# EAGLE design UCirKitUserStudy4 (EAGLE 7.3.0)
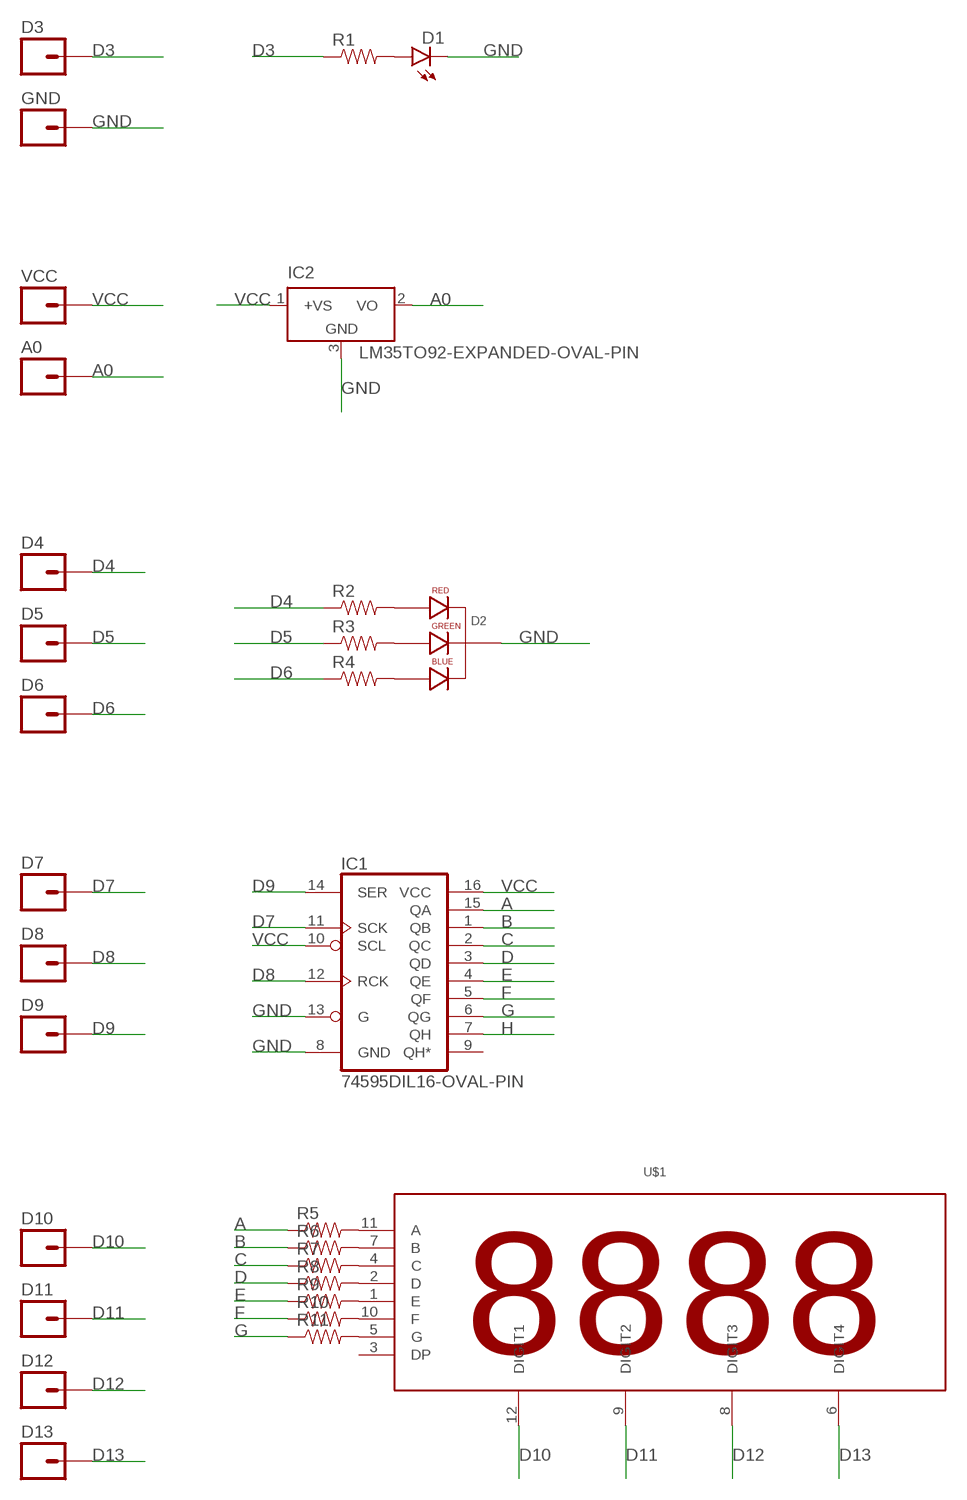
[diagram p0: schematic, sheet 1]

## Parts
A0  M01OVAL_PIN  [1X01_OVAL_PIN]
D1  LEDLED3MM-EXPANDED-OVAL-PIN  [LED3MM-EXPANDED-OVAL-PIN]
D2  LED-RGB-CC-THRULED-RGB-THRU-EXPANDED-OVAL-PIN  [LED-RGB-THRU-EXPANDED-OVAL-PIN]
D3  M01OVAL_PIN  [1X01_OVAL_PIN]
D4  M01OVAL_PIN  [1X01_OVAL_PIN]
D5  M01OVAL_PIN  [1X01_OVAL_PIN]
D6  M01OVAL_PIN  [1X01_OVAL_PIN]
D7  M01OVAL_PIN  [1X01_OVAL_PIN]
D8  M01OVAL_PIN  [1X01_OVAL_PIN]
D9  M01OVAL_PIN  [1X01_OVAL_PIN]
D10  M01OVAL_PIN  [1X01_OVAL_PIN]
D11  M01OVAL_PIN  [1X01_OVAL_PIN]
D12  M01OVAL_PIN  [1X01_OVAL_PIN]
D13  M01OVAL_PIN  [1X01_OVAL_PIN]
GND  M01OVAL_PIN  [1X01_OVAL_PIN]
IC1  74595DIL16-OVAL-PIN  [DIL16-OVAL-PIN]
IC2  LM35TO92-EXPANDED-OVAL-PIN  [TO92-EXPANDED-OVAL-PIN]
R1  1KOHM-1/4W-1%(PTH)PTH-EXPANDED-OVAL-PIN  [PTH-EXPANDED-OVAL-PIN]
R2  1KOHM-1/4W-1%(PTH)PTH-EXPANDED-OVAL-PIN  [PTH-EXPANDED-OVAL-PIN]
R3  1KOHM-1/4W-1%(PTH)PTH-EXPANDED-OVAL-PIN  [PTH-EXPANDED-OVAL-PIN]
R4  1KOHM-1/4W-1%(PTH)PTH-EXPANDED-OVAL-PIN  [PTH-EXPANDED-OVAL-PIN]
R5  1KOHM-1/4W-1%(PTH)PTH-EXPANDED-OVAL-PIN  [PTH-EXPANDED-OVAL-PIN]
R6  1KOHM-1/4W-1%(PTH)PTH-EXPANDED-OVAL-PIN  [PTH-EXPANDED-OVAL-PIN]
R7  1KOHM-1/4W-1%(PTH)PTH-EXPANDED-OVAL-PIN  [PTH-EXPANDED-OVAL-PIN]
R8  1KOHM-1/4W-1%(PTH)PTH-EXPANDED-OVAL-PIN  [PTH-EXPANDED-OVAL-PIN]
R9  1KOHM-1/4W-1%(PTH)PTH-EXPANDED-OVAL-PIN  [PTH-EXPANDED-OVAL-PIN]
R10  1KOHM-1/4W-1%(PTH)PTH-EXPANDED-OVAL-PIN  [PTH-EXPANDED-OVAL-PIN]
R11  1KOHM-1/4W-1%(PTH)PTH-EXPANDED-OVAL-PIN  [PTH-EXPANDED-OVAL-PIN]
U$1  4DIGIT_SEVEN_SEGMENT4DIGIT_SEVEN_SEGMENT_OVAL_PIN  [4DIGIT_SEVEN_SEGMENT_OVAL_PIN]
VCC  M01OVAL_PIN  [1X01_OVAL_PIN]

## Nets
A: IC1.15(QA) R5.P$1
A0: A0.1 IC2.2(VO)
B: IC1.1(QB) R6.P$1
C: IC1.2(QC) R7.P$1
D: IC1.3(QD) R8.P$1
D3: D3.1 R1.P$1
D4: D4.1 R2.P$1
D5: D5.1 R3.P$1
D6: D6.1 R4.P$1
D7: D7.1 IC1.11(SCK)
D8: D8.1 IC1.12(RCK)
D9: D9.1 IC1.14(SER)
D10: D10.1 U$1.12(DIGIT1)
D11: D11.1 U$1.9(DIGIT2)
D12: D12.1 U$1.8(DIGIT3)
D13: D13.1 U$1.6(DIGIT4)
E: IC1.4(QE) R9.P$1
F: IC1.5(QF) R10.P$1
G: IC1.6(QG) R11.P$1
GND: D1.K(C) D2.2(CATHODE) GND.1 IC1.8(GND) IC1.13(G) IC2.3(GND)
H: IC1.7(QH)
N$1: D1.A R1.P$2
N$2: D2.1(RED_CATHODE) R2.P$2
N$3: D2.3(GREEN_CATHODE) R3.P$2
N$4: D2.4(BLUE_CATHODE) R4.P$2
N$5: R5.P$2 U$1.11(A)
N$6: R6.P$2 U$1.7(B)
N$7: R7.P$2 U$1.4(C)
N$8: R8.P$2 U$1.2(D)
N$9: R9.P$2 U$1.1(E)
N$10: R10.P$2 U$1.10(F)
N$11: R11.P$2 U$1.5(G)
VCC: IC1.10(SCL) IC1.16(VCC) IC2.1(+VS) VCC.1
Unconnected: IC1.9(QH*) U$1.3(DP)

## Library data of the parts
A0 D3-D13 GND VCC = SparkFun-Connectors:M01: Header 1 Standard 1-pin 0.1" header. Use with straight break away headers (SKU : PRT-00116), right angle break away headers (PRT-00553), swiss pins (PRT-00743), machine pins (PRT-00117), and female headers (PRT-00115).
D1 = SparkFun-LED:LED: LEDs Standard schematic elements and footprints for 5mm, 3mm, 1206, and 0603 sized LEDs. 5mm - Spark Fun Electronics SKU : COM-00529 (and others)
D2 = SparkFun-LED:LED-RGB-CC-THRU: RGB Through-hole common cathode LED SparkFun Storefront: COM-00105 (Clear) COM-09264 (Diffuse)
IC1 = SparkFun-DigitalIC:74*595: 8-bit SHIFT REGISTER, output latch
IC2 = lm35:LM35: Single-Supply Centigrade Temperature Sensor Vout = (10mV/°C x Temp °C) +5mmmV Source: http://www.national.com/ds/LM/LM35.pdf
R1-R11 = SparkFun-Resistors:1KOHM-1/4W-1%(PTH): RES-12182
U$1 = led-7-segment:4DIGIT_SEVEN_SEGMENT

## Board
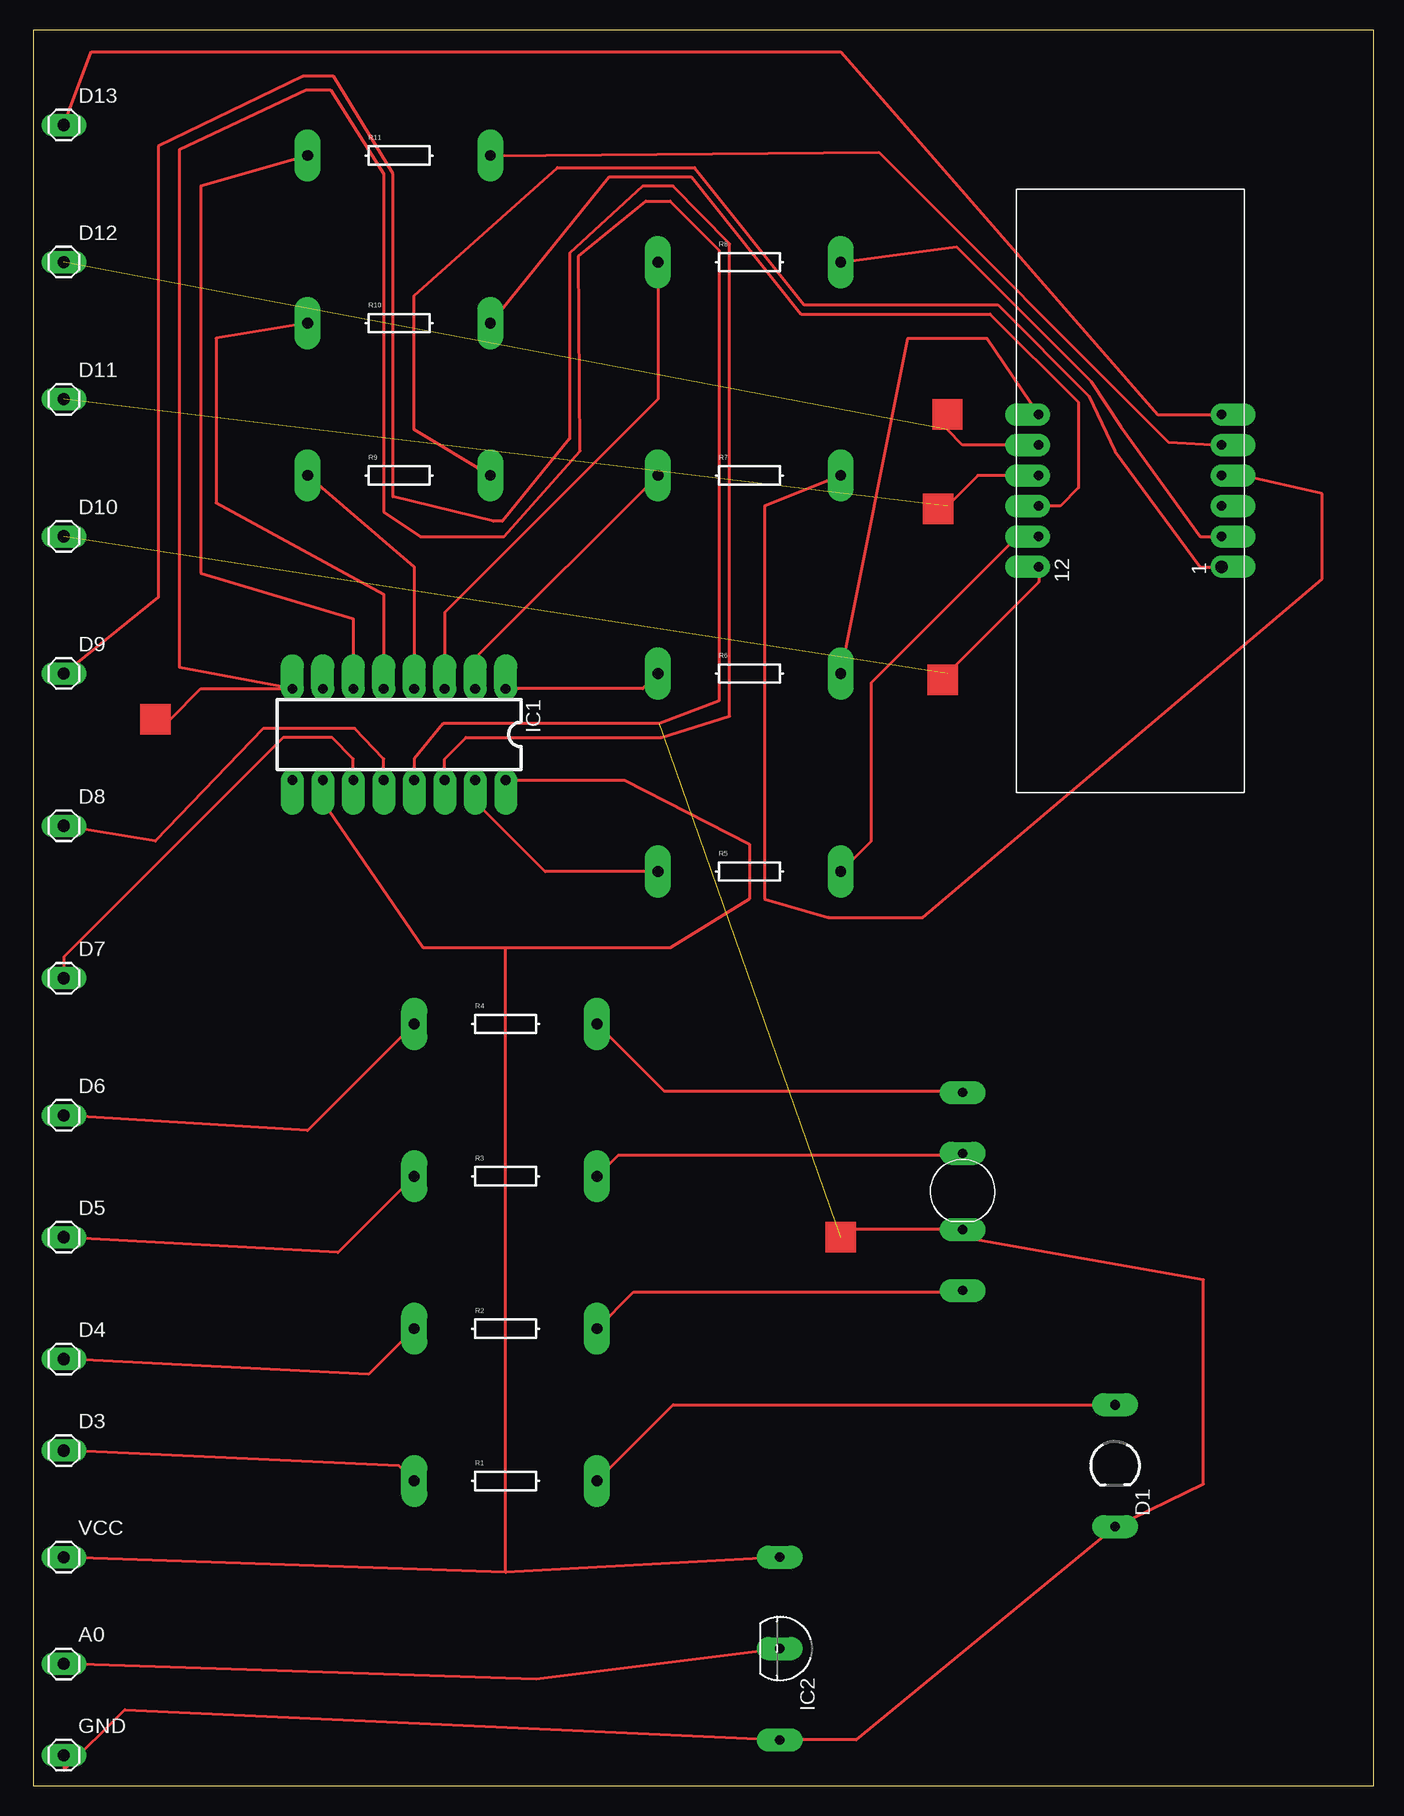
[diagram p1: board, top side]

Size 111.74 x 146.35 mm. Coordinates in mm from the lower left corner, seen from the top.
Outline: 0,0 111.74,0 111.74,146.35 0,146.35 0,0
Copper layers (1*16): Top 0.035mm / dielectric 1.5mm / Bottom 0.035mm
Design rules "default *": minimum track width 10mil, minimum drill 24mil, track to track 10mil, track to pad 50mil, pad to pad 9mil, via to via 9mil, smd to smd 8mil, copper to edge 40mil, drill to drill 8mil, minimum pad ring 10mil, minimum via ring 8mil, stop-mask expansion 4mil, vias tented up to drill 0mil, thermal gap 10mil

### Footprints (pad centres in the part's own frame; a part is rotated, then mirrored left to right if it is on the bottom)
1X01_OVAL_PIN = drill 1.016 pad 1.88 long: 1 0,0
LED3MM-EXPANDED-OVAL-PIN = drill 0.813 pad 1.93 long: A -5.08,0; K 5.08,0
LED-RGB-THRU-EXPANDED-OVAL-PIN = drill 0.762 pad 1.93 long: 1 8.255,0; 2 3.175,0; 3 -3.175,0; 4 -8.255,0
DIL16-OVAL-PIN = drill 0.813 pad 1.93 offset: 1 -8.89,-3.81; 2 -6.35,-3.81; 3 -3.81,-3.81; 4 -1.27,-3.81; 5 1.27,-3.81; 6 3.81,-3.81; 7 6.35,-3.81; 8 8.89,-3.81; 9 8.89,3.81; 10 6.35,3.81; 11 3.81,3.81; 12 1.27,3.81; 13 -1.27,3.81; 14 -3.81,3.81; 15 -6.35,3.81; 16 -8.89,3.81
TO92-EXPANDED-OVAL-PIN = drill 0.813 pad 1.93 long: 1 -7.62,0; 2 0,0; 3 7.62,0
PTH-EXPANDED-OVAL-PIN = drill 0.9 pad 2.184 long: P$1 -7.62,0; P$2 7.62,0
4DIGIT_SEVEN_SEGMENT_OVAL_PIN = drill 1.016 pad 1.88 offset: 1 -6.35,-7.62 | drill 0.8 pad 1.88 offset: 2 -3.81,-7.62; 3 -1.27,-7.62; 4 1.27,-7.62; 5 3.81,-7.62; 6 6.35,-7.62; 7 6.35,7.62; 8 3.81,7.62; 9 1.27,7.62; 10 -1.27,7.62; 11 -3.81,7.62; 12 -6.35,7.62

### Placement (x,y rotation side)
A0  2.54,10.16 0 top
D1  90.17,26.67 270 top
D2  77.47,49.53 270 top
D3  2.54,27.94 0 top
D4  2.54,35.56 0 top
D5  2.54,45.72 0 top
D6  2.54,55.88 0 top
D7  2.54,67.31 0 top
D8  2.54,80.01 0 top
D9  2.54,92.71 0 top
D10  2.54,104.14 0 top
D11  2.54,115.57 0 top
D12  2.54,127 0 top
D13  2.54,138.43 0 top
GND  2.54,2.54 0 top
IC1  30.48,87.63 180 top
IC2  62.23,11.43 270 top
R1  39.37,25.4 0 top
R2  39.37,38.1 0 top
R3  39.37,50.8 0 top
R4  39.37,63.5 0 top
R5  59.69,76.2 0 top
R6  59.69,92.71 0 top
R7  59.69,109.22 0 top
R8  59.69,127 0 top
R9  30.48,109.22 0 top
R10  30.48,121.92 0 top
R11  30.48,135.89 0 top
U$1  91.44,107.95 90 top
VCC  2.54,19.05 0 top

### Tracks (layer width: path | path; a pad name or v marks a point on that pad's centre or on a via)
A
  Top 0.254: IC1.15 36.83,82.04 42.67,76.2 R5.P$1
A0
  Top 0.254: A0.1 41.91,8.89 IC2.2
B
  Top 0.254: IC1.1 50.8,91.44 R6.P$1
C
  Top 0.254: IC1.2 36.83,93.98 R7.P$1
D
  Top 0.254: IC1.3 34.29,97.79 52.07,115.57 R8.P$1
D3
  Top 0.254: D3.1 30.48,26.67 R1.P$1
D4
  Top 0.254: D4.1 27.94,34.29 R2.P$1
D5
  Top 0.254: D5.1 25.4,44.45 R3.P$1
D6
  Top 0.254: D6.1 22.86,54.61 R4.P$1
D7
  Top 0.254: D7.1 2.54,69.09 20.83,87.38 24.89,87.38 26.67,85.6 IC1.11
D8
  Top 0.254: D8.1 10.16,78.74 19.18,88.14 26.8,88.14 29.21,85.6 IC1.12
D9
  Top 0.254: D9.1 10.41,99.06 10.41,136.65 22.48,142.49 25.02,142.49 29.97,134.37 29.97,107.44 38.35,105.41 39.12,105.41 44.7,112.27 44.7,127.76 50.8,133.35 53.34,133.35 58.04,128.52 58.04,89.15 52.32,87.38 36.07,87.38 34.29,85.6 IC1.14
D10  (1 unrouted)
  Top 0.254: U$1.12 83.82,100.33 76.2,92.71
D11  (1 unrouted)
  Top 0.254: U$1.9 78.74,109.22 76.2,106.68
D12  (1 unrouted)
  Top 0.254: U$1.8 77.47,111.76 76.2,113.03
D13
  Top 0.254: U$1.6 93.73,114.3 67.31,144.53 4.83,144.53 D13.1
E
  Top 0.254: IC1.4 31.75,101.6 R9.P$1
F
  Top 0.254: IC1.5 29.21,99.31 15.24,106.93 15.24,120.65 R10.P$1
G
  Top 0.254: IC1.6 26.67,97.28 13.97,101.09 13.97,133.35 R11.P$1
GND  (1 unrouted)
  Top 0.254: IC1.13 31.75,85.6 34.16,88.52 52.2,88.52 57.15,90.42 57.15,128.02 53.09,132.08 51.05,132.08 45.47,127.51 45.59,111.25 39.24,104.14 32.26,104.14 29.21,106.17 29.21,134.37 24.77,141.35 22.73,141.35 12.19,136.4 12.19,93.22 IC1.8 13.97,91.44 11.43,88.9 10.16,88.9 | GND.1 2.54,1.27 7.62,6.35 IC2.3 68.58,3.81 D1.K 97.54,25.15 97.54,42.16 77.47,45.72 D2.2 67.94,46.35 67.31,45.72
N$1
  Top 0.254: D1.A 53.34,31.75 R1.P$2
N$2
  Top 0.254: R2.P$2 50.04,41.15 77.47,41.15 D2.1
N$3
  Top 0.254: R3.P$2 48.77,52.58 77.47,52.58 D2.3
N$4
  Top 0.254: R4.P$2 52.58,57.91 77.47,57.91 D2.4
N$5
  Top 0.254: U$1.11 82.04,104.14 69.85,91.95 69.85,78.74 R5.P$2
N$6
  Top 0.254: U$1.7 79.5,120.65 72.9,120.65 R6.P$2
N$7
  Top 0.254: U$1.4 100.84,109.22 107.44,107.7 107.44,100.58 74.17,72.39 66.29,72.39 60.96,73.91 60.96,106.68 R7.P$2
N$8
  Top 0.254: U$1.2 97.28,104.14 90.68,113.28 88.14,117.09 76.96,128.27 R8.P$2
N$9
  Top 0.254: U$1.1 97.28,101.6 90.17,111.25 88.01,115.82 80.39,123.44 64.26,123.44 55.12,134.87 43.69,134.87 31.75,124.21 31.75,113.03 R9.P$2
N$10
  Top 0.254: U$1.10 85.6,106.68 87.12,108.2 87.12,115.32 79.76,122.68 64.01,122.68 54.86,134.11 48.01,134.11 R10.P$2
N$11
  Top 0.254: U$1.5 94.61,112.01 70.48,136.14 R11.P$2
VCC
  Top 0.254: IC1.10 24.13,82.04 32.51,69.85 39.37,69.85 | 39.37,69.85 53.09,69.85 59.69,73.91 59.69,78.49 49.28,83.82 IC1.16 | 39.37,17.78 VCC.1 | IC2.1 39.37,17.78 | 39.37,17.78 39.37,69.85
(copper drawn outside any net)
  shapes: Top area x5